# Altium project PCB_Project.PrjPcb
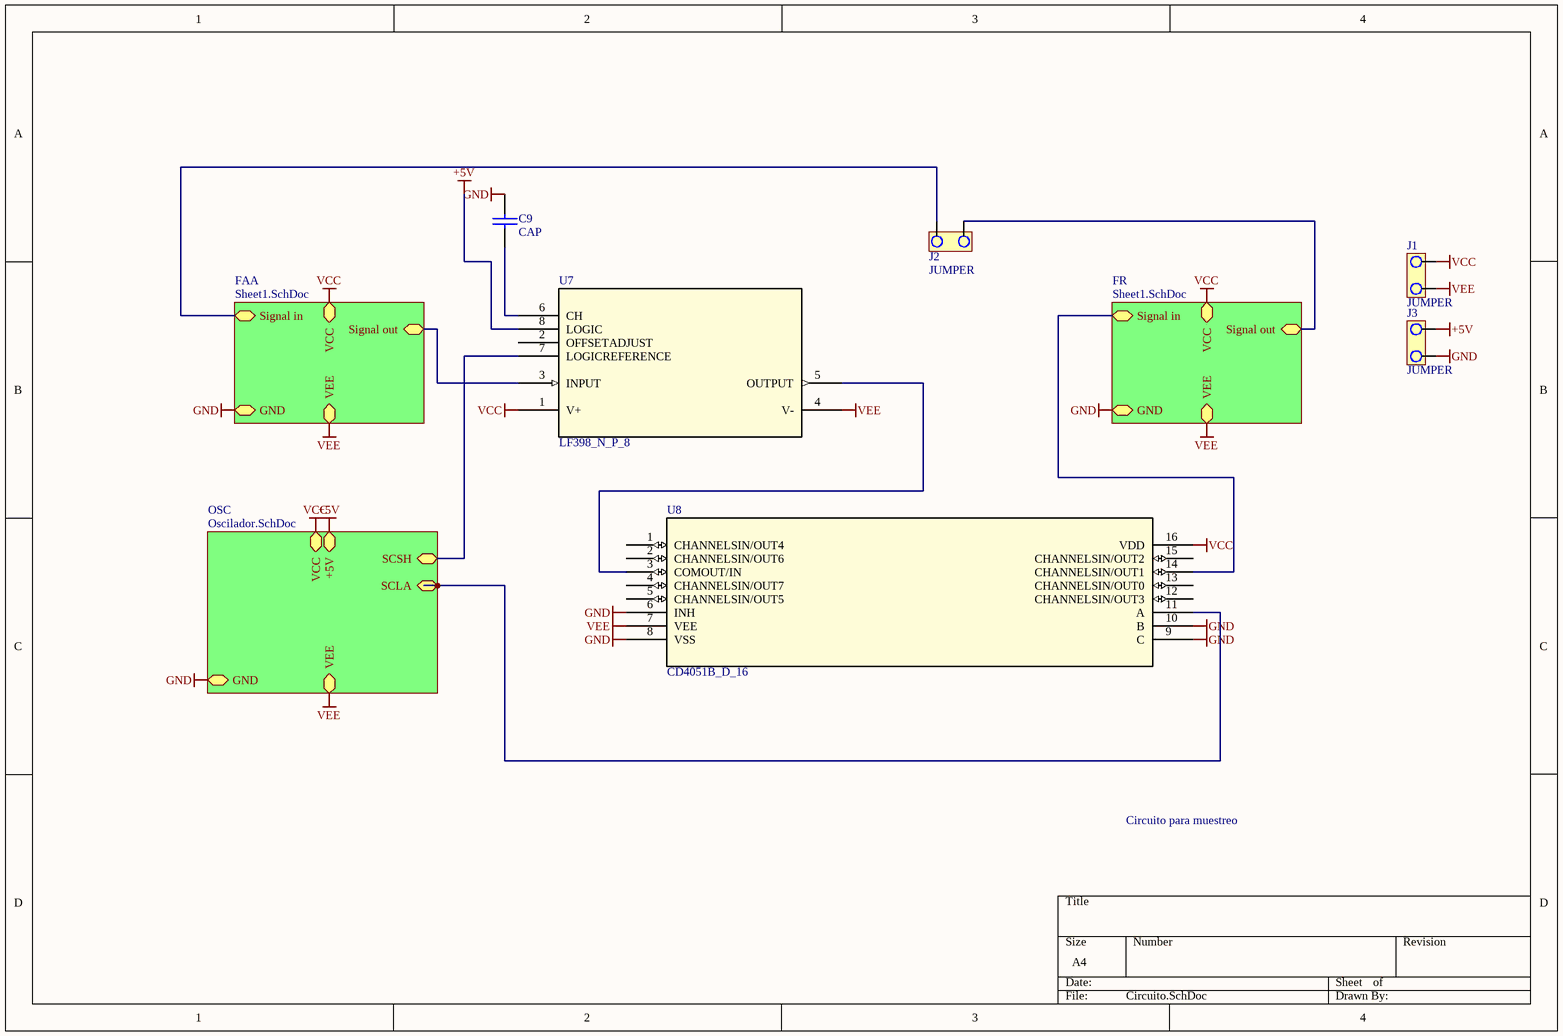
[diagram p0: Circuito.SchDoc]
4 sheets, 116 parts. Net scope: strictly hierarchical (ports join the sheet entries above them; power ports are local).
Board file: PCB1.PcbDoc
Sheets:
  Circuito.SchDoc
    FAA = Sheet1.SchDoc
      Celda C = SallenKeyLowPass.SchDoc
      Celda D = SallenKeyLowPass.SchDoc
      Celda B = SallenKeyLowPass.SchDoc
    FR = Sheet1.SchDoc
      Celda C = SallenKeyLowPass.SchDoc
      Celda D = SallenKeyLowPass.SchDoc
      Celda B = SallenKeyLowPass.SchDoc
    OSC = Oscilador.SchDoc

## Sheet Circuito.SchDoc
size A4

### Parts
C9  CAP  [CAP100]
J1  JUMPER  [JUMPER2]
J2  JUMPER  [JUMPER2]
J3  JUMPER  [JUMPER2]
U7  LF398_N_P_8  [P8]
U8  CD4051B_D_16  [D16]

### Sub-sheets
FAA = Sheet1.SchDoc: Signal in, Signal out, GND, VEE, VCC
FR = Sheet1.SchDoc: Signal in, Signal out, GND, VEE, VCC
OSC = Oscilador.SchDoc: SCLA, SCSH, GND, +5V, VEE, VCC

### Nets
+5V: J3.1 U7.8(LOGIC) ; sheet OSC/+5V
GND: C9.1 J3.2 U8.6(INH) U8.8(VSS) U8.9(C) U8.10(B) ; sheet FAA/GND, sheet FR/GND, sheet OSC/GND  [project net Ground]
VCC: J1.1 U7.1(V+) U8.16(VDD) ; sheet FAA/VCC, sheet FR/VCC, sheet OSC/VCC
VEE: J1.2 U7.4(V-) U8.7(VEE) ; sheet FAA/VEE, sheet FR/VEE, sheet OSC/VEE
control: U8.11(A) ; sheet OSC/SCLA
pwm: U7.7(LOGICREFERENCE) ; sheet OSC/SCSH
NetC1_Celda_B1_2: U7.3(INPUT) ; sheet FAA/Signal out
NetC1_Celda_B2_2: J2.2 ; sheet FR/Signal out
NetC9_2: C9.2 U7.6(CH)
NetJ2_1: J2.1 ; sheet FAA/Signal in
NetR17_FR_1: U8.14(CHANNELSIN/OUT1) ; sheet FR/Signal in
NetU7_5: U7.5(OUTPUT) U8.3(COMOUT/IN)

Not connected (* = marked no-connect by the designer): U7 2(OFFSETADJUST); U8 1(CHANNELSIN/OUT4) 2(CHANNELSIN/OUT6) 4(CHANNELSIN/OUT7) 5(CHANNELSIN/OUT5) 12(CHANNELSIN/OUT3) 13(CHANNELSIN/OUT0) 15(CHANNELSIN/OUT2)

### Notes on the sheet
- Circuito para muestreo

### Library data of the parts
U7 = LF398_N_P_8: Imported; Manufacturer_Part_Number: lf398-n_p_8; Vendor: Texas Instruments; Value: Value; Type: Type; RefDes: RefDes
U8 = CD4051B_D_16: Imported; Manufacturer: Texas Instruments; INDUSTRY_STD_PKG_TYPE: SOIC; FAMILY_NAME: ANALOG SWITCH/MULTIPLEXER (greater than 5V); PIN_COUNT: 16; PACKAGE_DESIGNATOR: D; Datasheet_URL: http://www.ti.com/lit/gpn/CD4051B; GENERIC_PART_NUMBER: CD4051B; Value: Value; Type: Type; RefDes: RefDes

## Sheet Sheet1.SchDoc
size A4
Used 2 times, as channels FAA, FR. Parts and nets are listed once, with the designators drawn on the sheet.
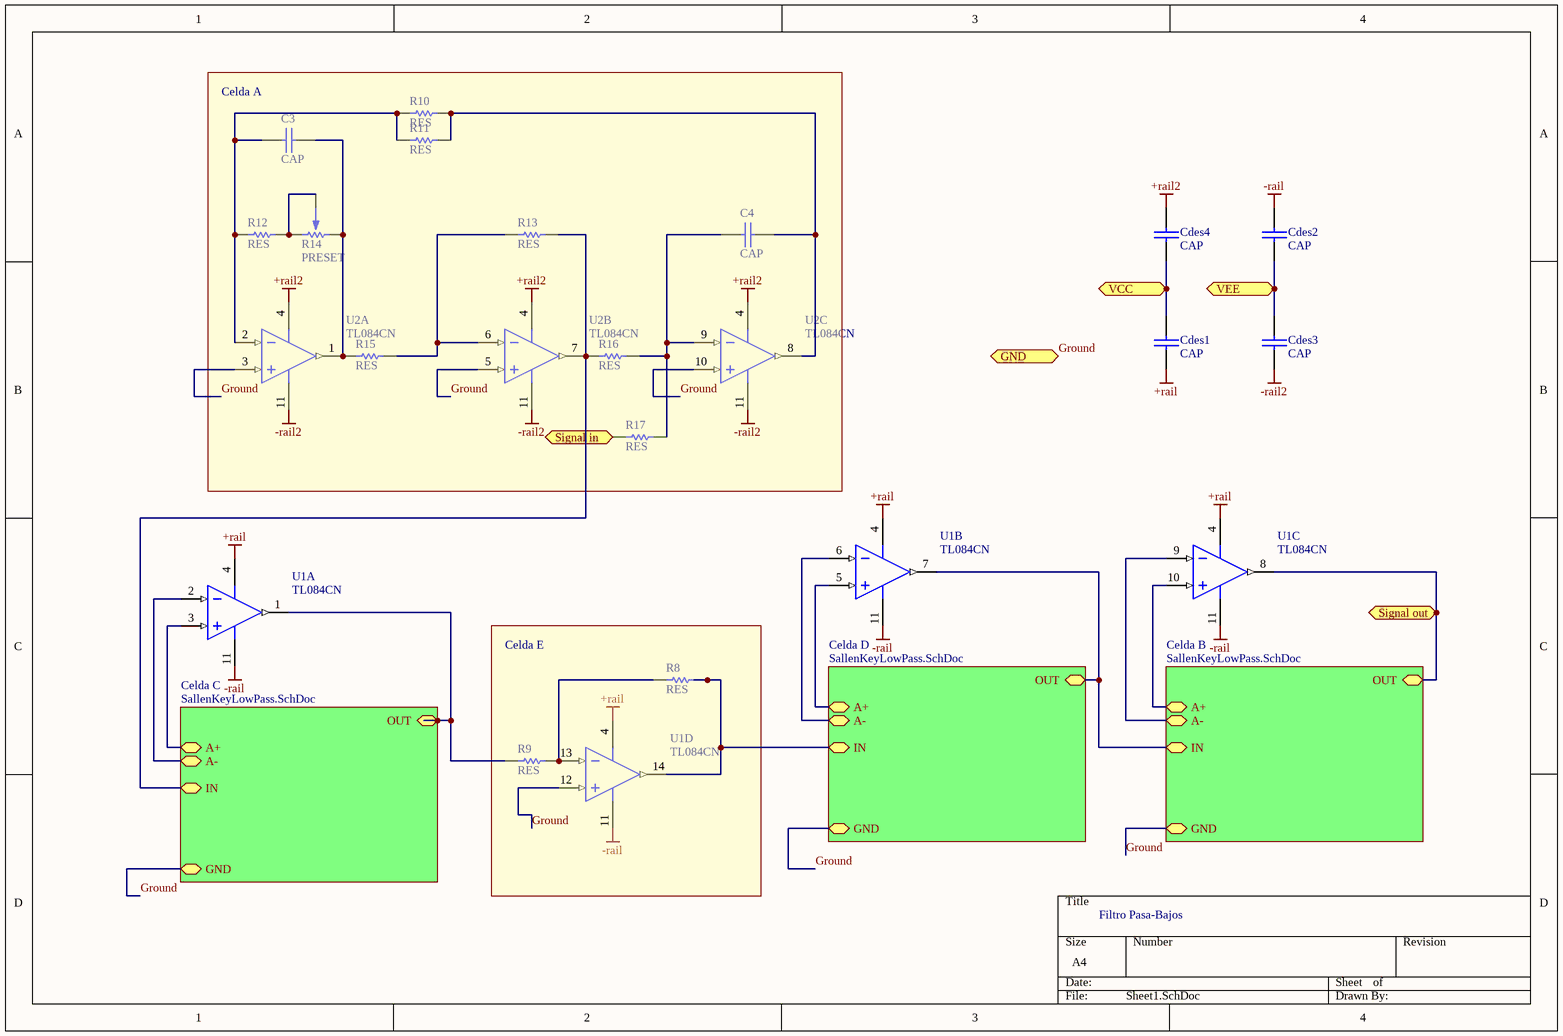
[diagram p1: Sheet1.SchDoc]

### Parts
C3  CAP  [CAP100]
C4  CAP  [CAP100]
Cdes1  CAP  [CAP100]
Cdes2  CAP  [CAP100]
Cdes3  CAP  [CAP100]
Cdes4  CAP  [CAP100]
R8  RES  [RES300]
R9  RES  [RES300]
R10  RES  [RES300]
R11  RES  [RES300]
R12  RES  [RES300]
R13  RES  [RES300]
R14  PRESET  [PRESET V]
R15  RES  [RES300]
R16  RES  [RES300]
R17  RES  [RES300]
U1  TL084CN  [TI-N14]  (parts A,B,C,D of 4)
U2  TL084CN  [TI-N14]  (parts A,B,C of 4)

### Blocks framed on the sheet
Celda A: C3 C4 R10-R17 U2
Celda E: R8 R9 U1

### Sub-sheets
Celda B = SallenKeyLowPass.SchDoc: IN, GND, OUT, A+, A-
Celda C = SallenKeyLowPass.SchDoc: IN, GND, OUT, A+, A-
Celda D = SallenKeyLowPass.SchDoc: IN, GND, OUT, A+, A-

### Ports
GND, Signal in, Signal out, VCC, VEE

### Nets
+rail: Cdes1.2 U1.4(VCC+)
+rail2: Cdes4.1 U2.4(VCC+)
-rail: Cdes2.1 U1.11(VCC-)
-rail2: Cdes3.2 U2.11(VCC-)
Ground: U1.12(IN4+) U2.3(IN1+) U2.5(IN2+) U2.10(IN3+) ; port GND, sheet Celda C/GND, sheet Celda D/GND, sheet Celda B/GND
Signal in: R17.1 ; port Signal in
Signal out: U1.8(OUT3) ; port Signal out, sheet Celda B/OUT
VCC: Cdes1.1 Cdes4.2 ; port VCC
VEE: Cdes2.2 Cdes3.1 ; port VEE
NetC3_1: C3.1 R10.1 R11.1 R12.1 U2.2(IN1-)
NetC3_2: C3.2 R14.3 R15.1 U2.1(OUT1)
NetC4_1: C4.1 R16.2 R17.2 U2.9(IN3-)
NetC4_2: C4.2 R10.2 R11.2 U2.8(OUT3)
NetR8_1: R8.1 R9.2 U1.13(IN4-)
NetR8_2: R8.2 U1.14(OUT4) ; sheet Celda D/IN
NetR9_1: R9.1 U1.1(OUT1) ; sheet Celda C/OUT
NetR12_2: R12.2 R14.1 R14.2
NetR13_1: R13.1 R15.2 U2.6(IN2-)
NetR13_2: R13.2 R16.1 U2.7(OUT2) ; sheet Celda C/IN
NetU1_2: U1.2(IN1-) ; sheet Celda C/A-
NetU1_3: U1.3(IN1+) ; sheet Celda C/A+
NetU1_5: U1.5(IN2+) ; sheet Celda D/A+
NetU1_6: U1.6(IN2-) ; sheet Celda D/A-
NetU1_7: U1.7(OUT2) ; sheet Celda D/OUT, sheet Celda B/IN
NetU1_9: U1.9(IN3-) ; sheet Celda B/A-
NetU1_10: U1.10(IN3+) ; sheet Celda B/A+

### Channels
FAA: designators end in _FAA; ports GND=Ground Signal in=NetJ2_1 Signal out=NetC1_Celda_B1_2 VCC=VCC VEE=VEE
FR: designators end in _FR; ports GND=Ground Signal in=NetR17_FR_1 Signal out=NetC1_Celda_B2_2 VCC=VCC VEE=VEE

### Notes on the sheet
- Filtro Pasa-Bajos

### Library data of the parts
U1 U2 = TL084CN: JFET-Input Operational Amplifier, 7 to 36 V, 0 to 70 degC, 14-pin DIP (N14), Pb-Free (RoHS); Manufacturer: Texas Instruments; CMRR(Min)(dB): 70; GBW(Typ)(MHz): 3; IIB(Max)(pA): 400; Iq per channel(Max)(mA): 2.8; Number of Channels: 4; Offset Drift(Typ)(uV/C): 18; Rating: Catalog; Slew Rate(Typ)(V/us): 13; Sub Family: General Purpose Amplifier, High Supply Voltage Amplifier (>=30V); Total Supply Voltage(Max)(+5V is 5, +/-5V is 10): 36; Total Supply Voltage(Min)(+5V is 5, +/-5V is 10): 7; Vio (25C)(Max)(mV): 15; DatasheetVersion: SLOS081G; PackageVersion: 4040049/E, 12/2002; PackageReference: N14; PackageDescription: 14-Pin Plastic In-Line, Body 19.305 x 6.35 mm, Pitch 2.54 mm; Supplier 1: Digi-Key; Supplier Part Number 1: 296-1784-5-ND; Supplier 2: Farnell; Supplier Part Number 2: 1106020; Supplier 3: Newark; Supplier Part Number 3: 08F9374; Supplier 4: Mouser; Supplier Part Number 4: 595-TL084CN; Eco-Plan: Pb-Free (RoHS); Vn at 1kHz(Typ)(nV/rtHz): 18; Mounting Technology: Through Hole; Code_JEDEC: MS-001; PartNumber: TL084CN; ComponentLink1Description: Manufacturer URL; ComponentLink1URL: http://www.ti.com/; ComponentLink2Description: Datasheet; ComponentLink2URL: http://www.ti.com/lit/ds/symlink/tl084.pdf; ComponentLink3Description: Package Specification; ComponentLink3URL: http://www.ti.com/lit/ml/mpdi002c/mpdi002c.pdf

## Sheet SallenKeyLowPass.SchDoc
size A4
Used 6 times, as channels FAA/Celda C, FAA/Celda D, FAA/Celda B, FR/Celda C, FR/Celda D, FR/Celda B. Parts and nets are listed once, with the designators drawn on the sheet.
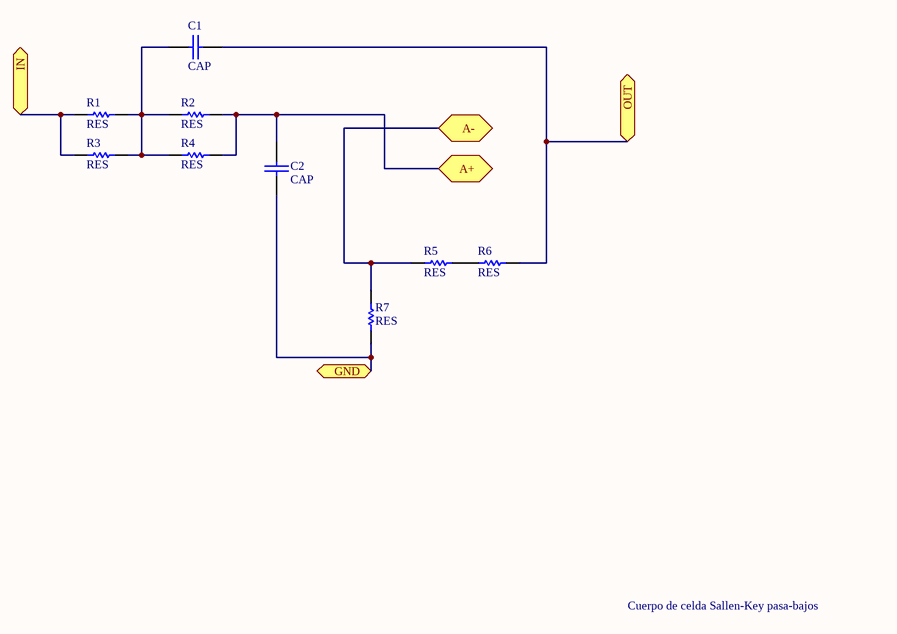
[diagram p2: SallenKeyLowPass.SchDoc]

### Parts
C1  CAP  [CAP100]
C2  CAP  [CAP100]
R1  RES  [RES300]
R2  RES  [RES300]
R3  RES  [RES300]
R4  RES  [RES300]
R5  RES  [RES300]
R6  RES  [RES300]
R7  RES  [RES300]

### Ports
A+, A-, GND, IN, OUT

### Nets
A+: C2.1 R2.2 R4.2 ; port A+
A-: R5.2 R7.2 ; port A-
GND: C2.2 R7.1 ; port GND
IN: R1.1 R3.1 ; port IN
OUT: C1.2 R6.1 ; port OUT
NetC1_1: C1.1 R1.2 R2.1 R3.2 R4.1
NetR5_1: R5.1 R6.2

### Channels
FAA/Celda C: designators end in _Celda_C1; ports A+=NetC2_Celda_C1_1 A-=NetR5_Celda_C1_2 GND=Ground IN=NetR1_Celda_C1_1 OUT=NetC1_Celda_C1_2
FAA/Celda D: designators end in _Celda_D1; ports A+=NetC2_Celda_D1_1 A-=NetR5_Celda_D1_2 GND=Ground IN=NetR1_Celda_D1_1 OUT=NetC1_Celda_D1_2
FAA/Celda B: designators end in _Celda_B1; ports A+=NetC2_Celda_B1_1 A-=NetR5_Celda_B1_2 GND=Ground IN=NetC1_Celda_D1_2 OUT=NetC1_Celda_B1_2
FR/Celda C: designators end in _Celda_C2; ports A+=NetC2_Celda_C2_1 A-=NetR5_Celda_C2_2 GND=Ground IN=NetR1_Celda_C2_1 OUT=NetC1_Celda_C2_2
FR/Celda D: designators end in _Celda_D2; ports A+=NetC2_Celda_D2_1 A-=NetR5_Celda_D2_2 GND=Ground IN=NetR1_Celda_D2_1 OUT=NetC1_Celda_D2_2
FR/Celda B: designators end in _Celda_B2; ports A+=NetC2_Celda_B2_1 A-=NetR5_Celda_B2_2 GND=Ground IN=NetC1_Celda_D2_2 OUT=NetC1_Celda_B2_2

### Notes on the sheet
- Cuerpo de celda Sallen-Key pasa-bajos

## Sheet Oscilador.SchDoc
size A4
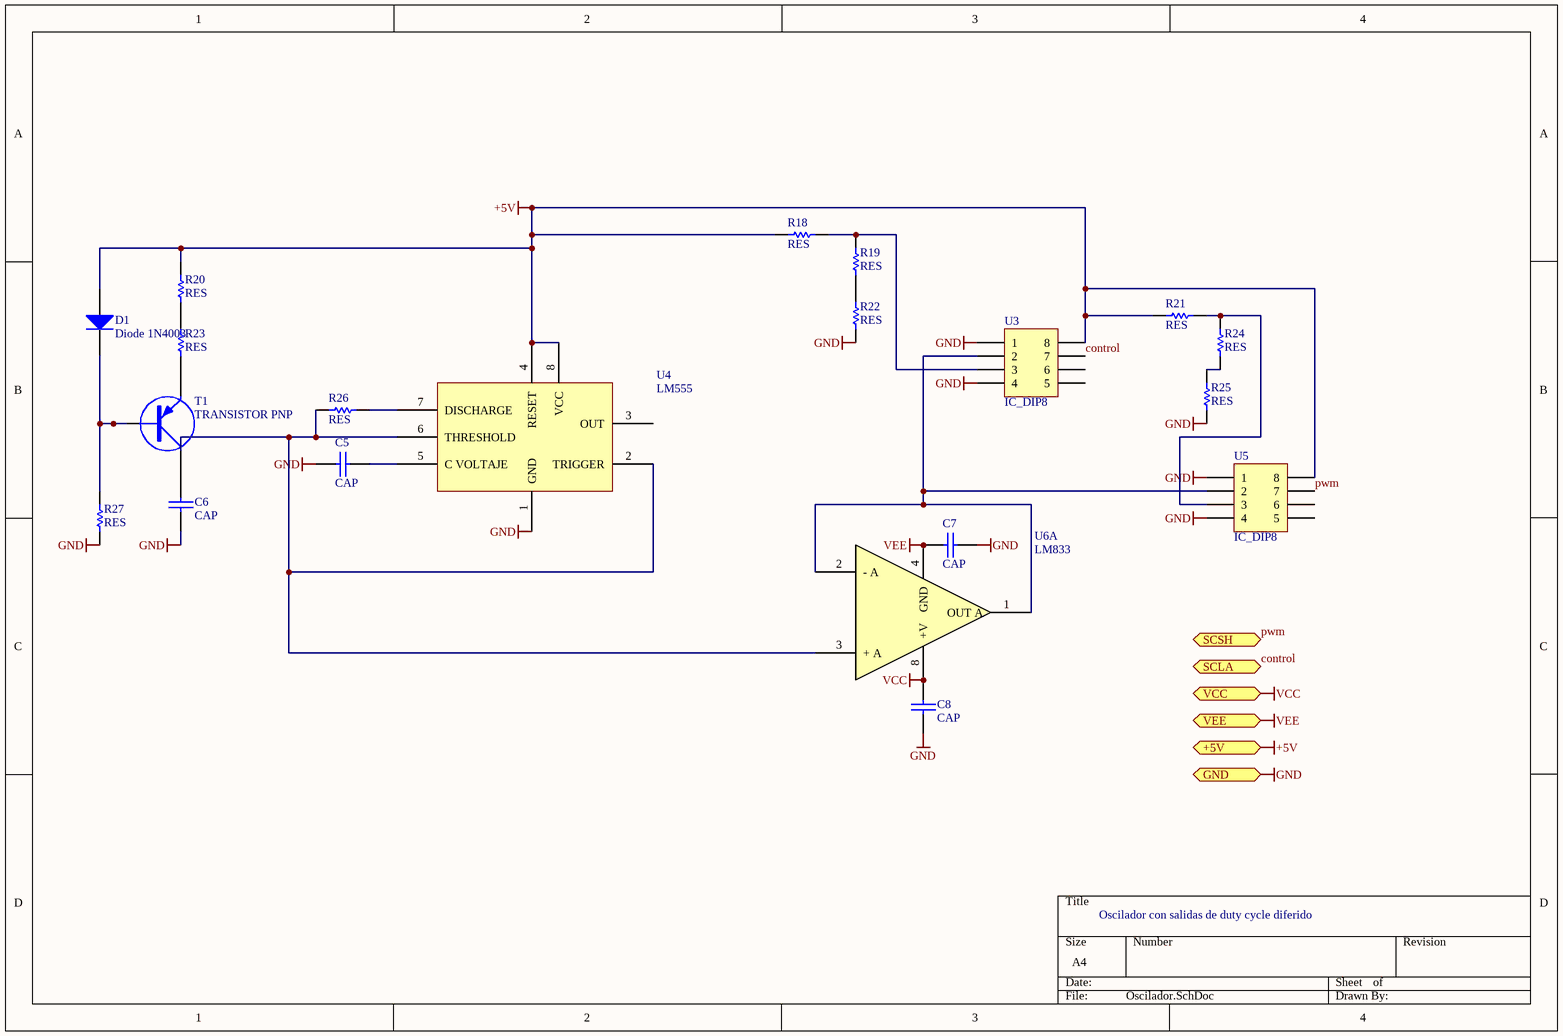
[diagram p3: Oscilador.SchDoc]

### Parts
C5  CAP  [CAP100]
C6  CAP  [CAP100]
C7  CAP  [CAP100]
C8  CAP  [CAP100]
D1  Diode 1N4003  [DO-41]
R18  RES  [RES300]
R19  RES  [RES300]
R20  RES  [RES300]
R21  RES  [RES300]
R22  RES  [RES300]
R23  RES  [RES300]
R24  RES  [RES300]
R25  RES  [RES300]
R26  RES  [RES300]
R27  RES  [RES300]
T1  TRANSISTOR PNP  [TO92]
U3  IC_DIP8  [DIP8]
U4  LM555  [DIP8]
U5  IC_DIP8  [DIP8]
U6  LM833  [DIP8]  (part A of 2)

### Ports
+5V, GND, SCLA, SCSH, VCC, VEE

### Nets
+5V: D1.1(A) R18.1 R20.2 R21.1 U3.8 U4.4(RESET) U4.8(VCC) U5.8 ; port +5V
GND: C5.2 C6.2 C7.2 C8.2 R22.1 R25.1 R27.1 U3.1 U3.4 U4.1(GND) U5.1 U5.4 ; port GND  [project net Ground]
VCC: C8.1 U6.8(+V) ; port VCC
VEE: C7.1 U6.4(GND) ; port VEE
control: U3.7 ; port SCLA
pwm: U5.7 ; port SCSH
NetC5_1: C5.1 U4.5(C_VOLTAJE)
NetC6_1: C6.1 T1.2(C)
NetD1_2: D1.2(K) R27.2 T1.1(B)
NetR18_2: R18.2 R19.2 U3.3
NetR19_1: R19.1 R22.2
NetR20_1: R20.1 R23.2
NetR21_2: R21.2 R24.2 U5.3
NetR23_1: R23.1 T1.3(E)
NetR24_1: R24.1 R25.2
NetR26_1: R26.1 U4.2(TRIGGER) U4.6(THRESHOLD) U6.3(+_A)
NetR26_2: R26.2 U4.7(DISCHARGE)
NetU3_2: U3.2 U5.2 U6.1(OUT_A) U6.2(-_A)

Not connected (* = marked no-connect by the designer): U3 5 6; U4 3(OUT); U5 5 6

### Notes on the sheet
- Oscilador con salidas de duty cycle diferido

### Library data of the parts
D1 = Diode 1N4003: 1 Amp General Purpose Rectifier; Published: 8-Jun-2000; LatestRevisionDate: 17-Jul-2002; LatestRevisionNote: Re-released for DXP Platform.; DatasheetVersion: 1998; PackageVersion: Aug-1999; PackageReference: DO-41; Publisher: Altium Limited; PackageDescription: Diode, Axial; Body 5.2 x 2.7 mm (LxDia. max), Lead Dia. 0.86 mm (max); Code_JEDEC: DO-204-AL; ComponentLink1Description: Manufacturer Link; ComponentLink1URL: http://www.fairchildsemi.com/; ComponentLink2Description: Datasheet; ComponentLink2URL: http://www.fairchildsemi.com/ds/1N%2F1N4001.pdf
U4 = LM555: Timer
U6 = LM833: Dual Audio Operational Amplifier

## Nets that join several sheets
+5V: Circuito (J3.1 U7.8), Oscilador (8 pins)
Ground: Circuito (6 pins), FAA (U1_FAA.12 U2_FAA.3 U2_FAA.5 U2_FAA.10), FAA/Celda C (C2_Celda_C1.2 R7_Celda_C1.1), FAA/Celda D (C2_Celda_D1.2 R7_Celda_D1.1), FAA/Celda B (C2_Celda_B1.2 R7_Celda_B1.1), FR (U1_FR.12 U2_FR.3 U2_FR.5 U2_FR.10), FR/Celda C (C2_Celda_C2.2 R7_Celda_C2.1), FR/Celda D (C2_Celda_D2.2 R7_Celda_D2.1), FR/Celda B (C2_Celda_B2.2 R7_Celda_B2.1), Oscilador (12 pins)
VCC: Circuito (J1.1 U7.1 U8.16), FAA (Cdes1_FAA.1 Cdes4_FAA.2), FR (Cdes1_FR.1 Cdes4_FR.2), Oscilador (C8.1 U6.8)
VEE: Circuito (J1.2 U7.4 U8.7), FAA (Cdes2_FAA.2 Cdes3_FAA.1), FR (Cdes2_FR.2 Cdes3_FR.1), Oscilador (C7.1 U6.4)
control: Circuito (U8.11), Oscilador (U3.7)
NetC1_Celda_B1_2: Circuito (U7.3), FAA (U1_FAA.8), FAA/Celda B (C1_Celda_B1.2 R6_Celda_B1.1)
NetC1_Celda_B2_2: Circuito (J2.2), FR (U1_FR.8), FR/Celda B (C1_Celda_B2.2 R6_Celda_B2.1)
NetC1_Celda_C1_2: FAA (R9_FAA.1 U1_FAA.1), FAA/Celda C (C1_Celda_C1.2 R6_Celda_C1.1)
NetC1_Celda_C2_2: FR (R9_FR.1 U1_FR.1), FR/Celda C (C1_Celda_C2.2 R6_Celda_C2.1)
NetC1_Celda_D1_2: FAA (U1_FAA.7), FAA/Celda D (C1_Celda_D1.2 R6_Celda_D1.1), FAA/Celda B (R1_Celda_B1.1 R3_Celda_B1.1)
NetC1_Celda_D2_2: FR (U1_FR.7), FR/Celda D (C1_Celda_D2.2 R6_Celda_D2.1), FR/Celda B (R1_Celda_B2.1 R3_Celda_B2.1)
NetC2_Celda_B1_1: FAA (U1_FAA.10), FAA/Celda B (C2_Celda_B1.1 R2_Celda_B1.2 R4_Celda_B1.2)
NetC2_Celda_B2_1: FR (U1_FR.10), FR/Celda B (C2_Celda_B2.1 R2_Celda_B2.2 R4_Celda_B2.2)
NetC2_Celda_C1_1: FAA (U1_FAA.3), FAA/Celda C (C2_Celda_C1.1 R2_Celda_C1.2 R4_Celda_C1.2)
NetC2_Celda_C2_1: FR (U1_FR.3), FR/Celda C (C2_Celda_C2.1 R2_Celda_C2.2 R4_Celda_C2.2)
NetC2_Celda_D1_1: FAA (U1_FAA.5), FAA/Celda D (C2_Celda_D1.1 R2_Celda_D1.2 R4_Celda_D1.2)
NetC2_Celda_D2_1: FR (U1_FR.5), FR/Celda D (C2_Celda_D2.1 R2_Celda_D2.2 R4_Celda_D2.2)
NetJ2_1: Circuito (J2.1), FAA (R17_FAA.1)
NetR1_Celda_C1_1: FAA (R13_FAA.2 R16_FAA.1 U2_FAA.7), FAA/Celda C (R1_Celda_C1.1 R3_Celda_C1.1)
NetR1_Celda_C2_1: FR (R13_FR.2 R16_FR.1 U2_FR.7), FR/Celda C (R1_Celda_C2.1 R3_Celda_C2.1)
NetR1_Celda_D1_1: FAA (R8_FAA.2 U1_FAA.14), FAA/Celda D (R1_Celda_D1.1 R3_Celda_D1.1)
NetR1_Celda_D2_1: FR (R8_FR.2 U1_FR.14), FR/Celda D (R1_Celda_D2.1 R3_Celda_D2.1)
NetR5_Celda_B1_2: FAA (U1_FAA.9), FAA/Celda B (R5_Celda_B1.2 R7_Celda_B1.2)
NetR5_Celda_B2_2: FR (U1_FR.9), FR/Celda B (R5_Celda_B2.2 R7_Celda_B2.2)
NetR5_Celda_C1_2: FAA (U1_FAA.2), FAA/Celda C (R5_Celda_C1.2 R7_Celda_C1.2)
NetR5_Celda_C2_2: FR (U1_FR.2), FR/Celda C (R5_Celda_C2.2 R7_Celda_C2.2)
NetR5_Celda_D1_2: FAA (U1_FAA.6), FAA/Celda D (R5_Celda_D1.2 R7_Celda_D1.2)
NetR5_Celda_D2_2: FR (U1_FR.6), FR/Celda D (R5_Celda_D2.2 R7_Celda_D2.2)
NetR17_FR_1: Circuito (U8.14), FR (R17_FR.1)
pwm: Circuito (U7.7), Oscilador (U5.7)